# EAGLE design schematic (EAGLE 9.6.2)

## Sheet 1 of 2
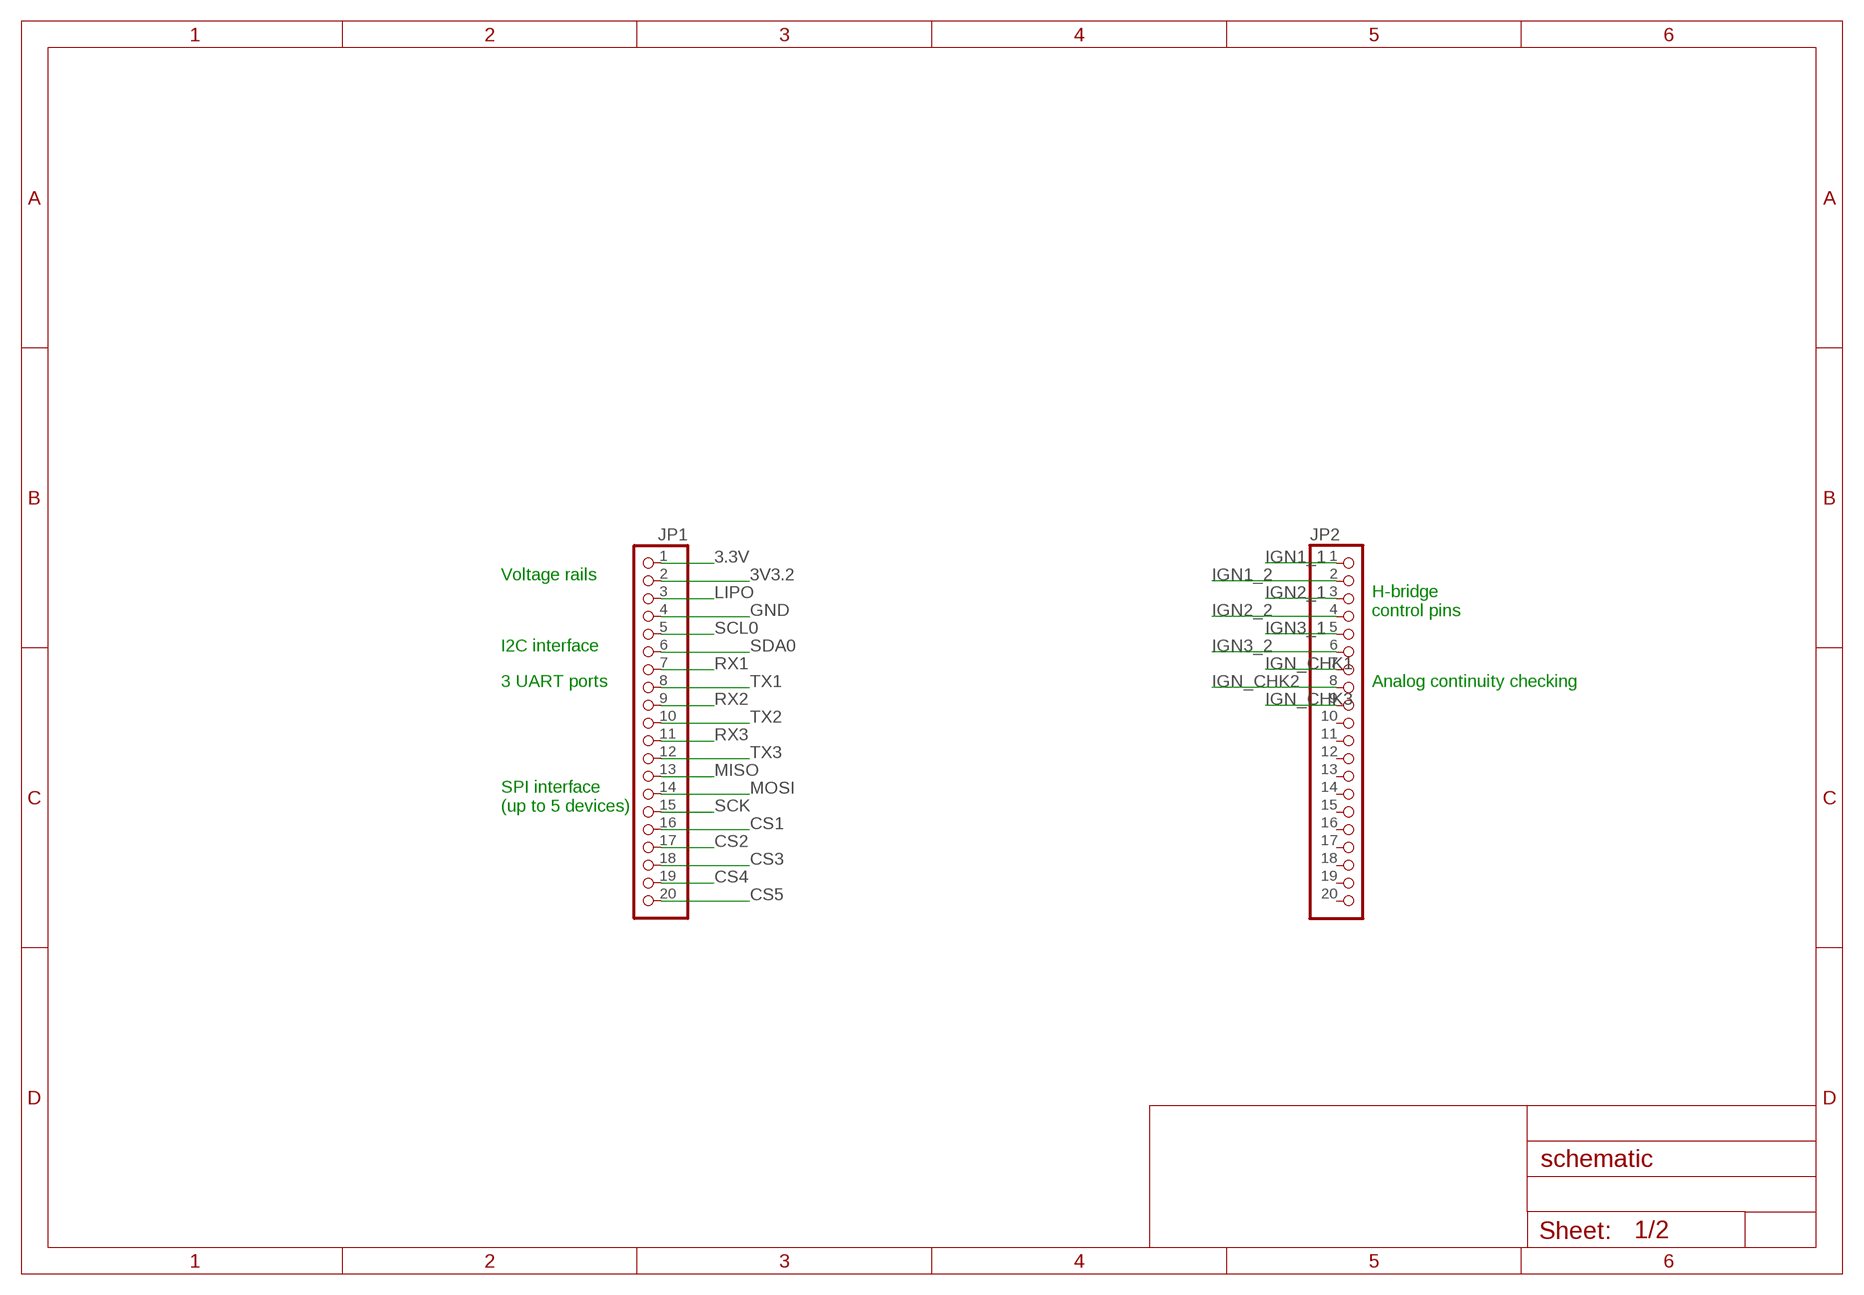
[diagram p0: schematic, sheet 1]

### Parts
JP1  PINHD-1X20  [1X20]
JP2  PINHD-1X20  [1X20]

### Nets
3.3V [POWER]: JP1.1 ; also sheet 2
3V3.2: JP1.2
CS1: JP1.16 ; also sheet 2
CS2: JP1.17 ; also sheet 2
CS3: JP1.18 ; also sheet 2
CS4: JP1.19 ; also sheet 2
CS5: JP1.20 ; also sheet 2
GND [POWER]: JP1.4 ; also sheet 2
IGN1_1: JP2.1 ; also sheet 2
IGN1_2: JP2.2 ; also sheet 2
IGN2_1: JP2.3 ; also sheet 2
IGN2_2: JP2.4 ; also sheet 2
IGN3_1: JP2.5 ; also sheet 2
IGN3_2: JP2.6 ; also sheet 2
IGN_CHK1: JP2.7 ; also sheet 2
IGN_CHK2: JP2.8 ; also sheet 2
IGN_CHK3: JP2.9 ; also sheet 2
LIPO [POWER]: JP1.3 ; also sheet 2
MISO: JP1.13 ; also sheet 2
MOSI: JP1.14 ; also sheet 2
RX1: JP1.7 ; also sheet 2
RX2: JP1.9 ; also sheet 2
RX3: JP1.11 ; also sheet 2
SCK: JP1.15 ; also sheet 2
SCL0: JP1.5 ; also sheet 2
SDA0: JP1.6 ; also sheet 2
TX1: JP1.8 ; also sheet 2
TX2: JP1.10 ; also sheet 2
TX3: JP1.12 ; also sheet 2
Unconnected: JP2.10 JP2.11 JP2.12 JP2.13 JP2.14 JP2.15 JP2.16 JP2.17 JP2.18 JP2.19 JP2.20

### Notes on the sheet
- Voltage rails
- H-bridge
  control pins
- I2C interface
- 3 UART ports | Analog continuity checking
- SPI interface
  (up to 5 devices)

## Sheet 2 of 2
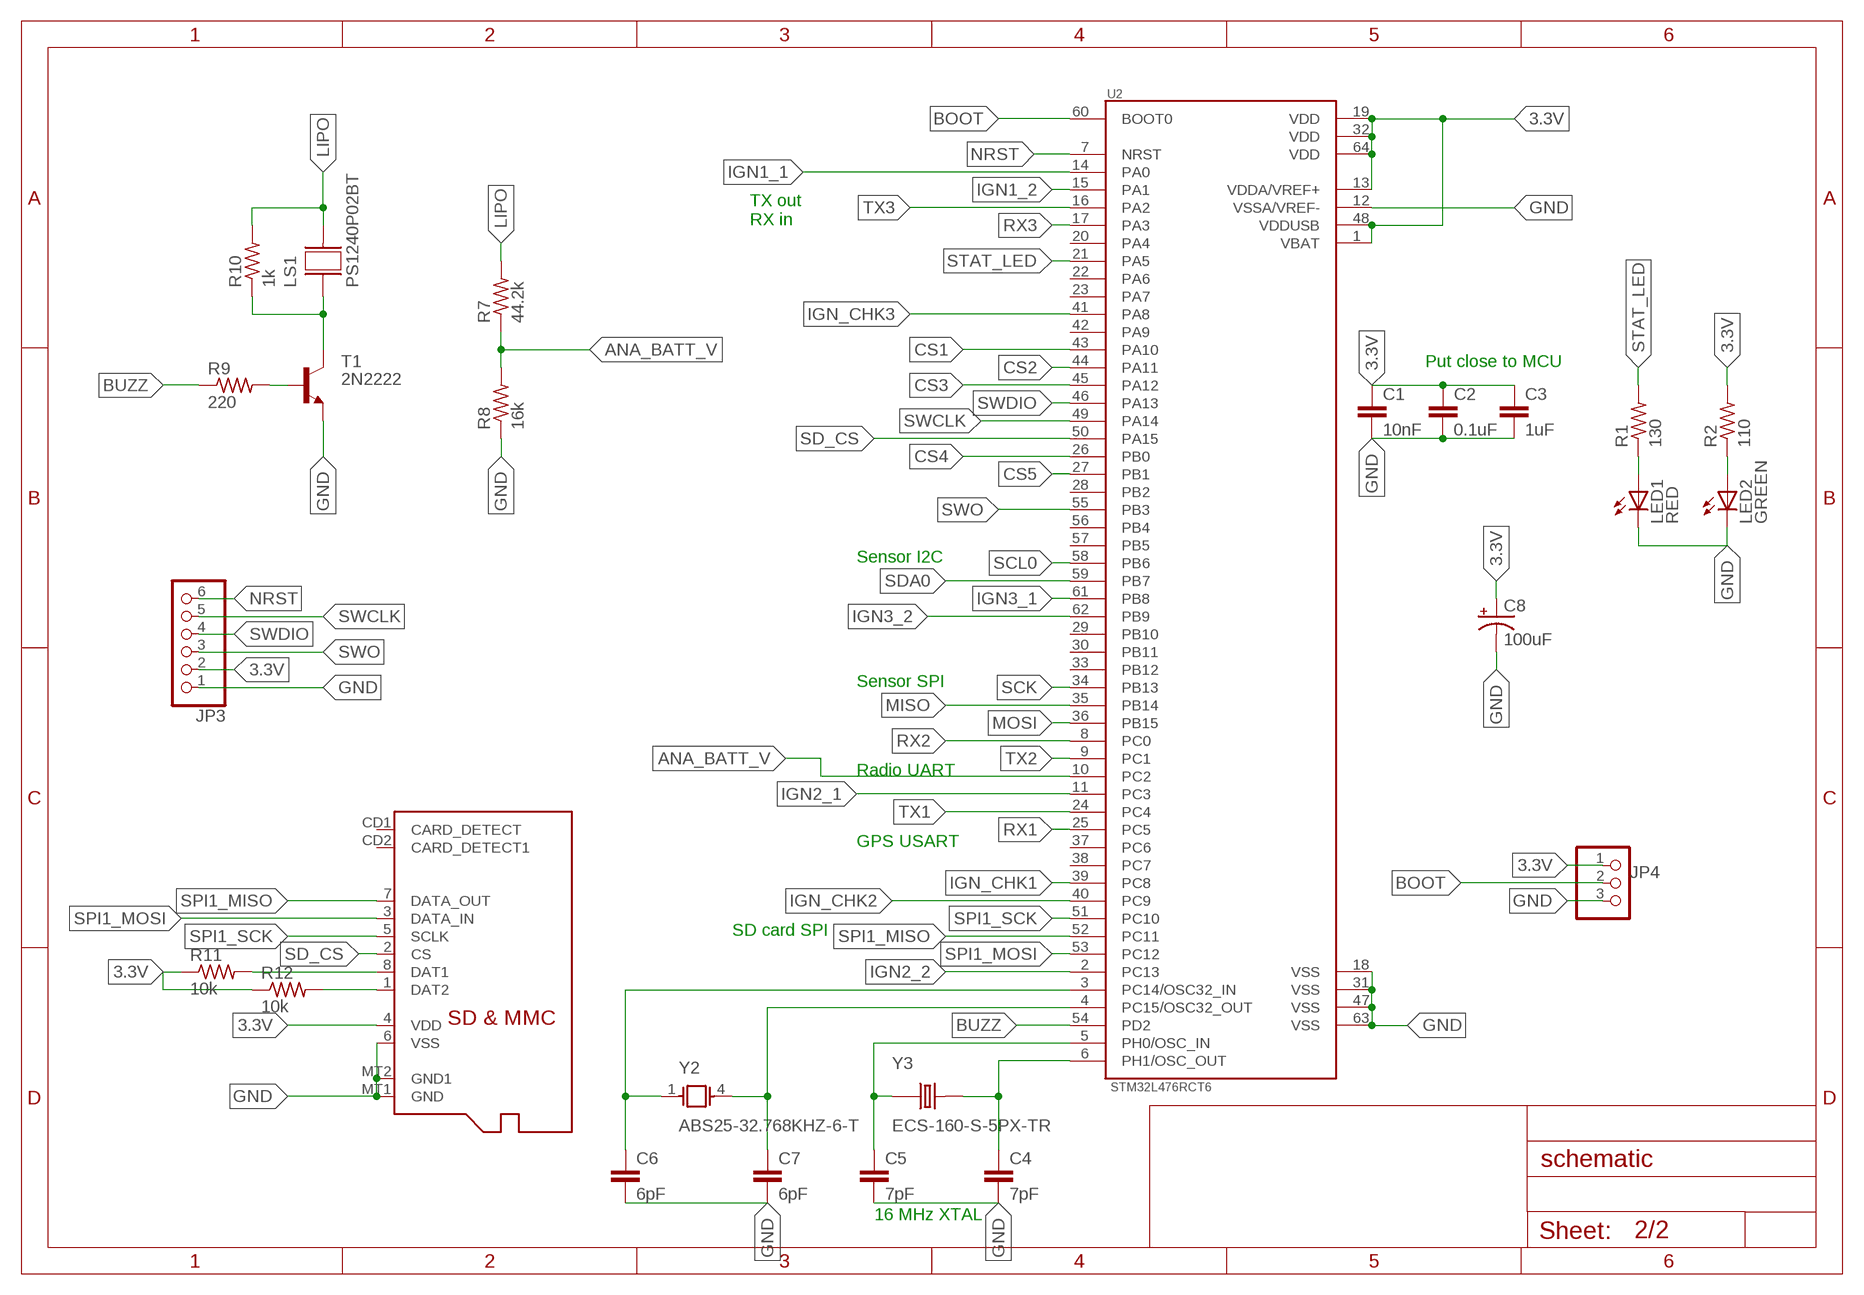
[diagram p1: schematic, sheet 2]

### Parts
C1  10nF  C-EUC0805  [C0805]
C2  0.1uF  C-EUC0805  [C0805]
C3  1uF  C-EUC0805  [C0805]
C4  7pF  C-EUC0805  [C0805]
C5  7pF  C-EUC0805  [C0805]
C6  6pF  C-EUC0805  [C0805]
C7  6pF  C-EUC0805  [C0805]
C8  100uF  CPOL-USB45181B  [B45181B]
JP3  PINHD-1X6  [1X06]
JP4  PINHD-1X3  [1X03]
LED1  RED  LEDCHIPLED_0805  [CHIPLED_0805]
LED2  GREEN  LEDCHIPLED_0805  [CHIPLED_0805]
LS1  PS1240P02BT  [XDCR_PS1240P02BT]
R1  130  R-US_R0805  [R0805]
R2  110  R-US_R0805  [R0805]
R7  44.2k  R-US_R0805  [R0805]
R8  16k  R-US_R0805  [R0805]
R9  220  R-US_R0805  [R0805]
R10  1k  R-US_R0805  [R0805]
R11  10k  R-US_R0805  [R0805]
R12  10k  R-US_R0805  [R0805]
T1  2N2222  [TO92-EBC-OVAL]
U2  STM32L476RCT6  [QFP50P120X120X160-64N]
U$1  MICROSD  [MICROSD]
Y2  ABS25-32.768KHZ-6-T  [XTAL_ABS25-32.768KHZ-6-T]
Y3  ECS-160-S-5PX-TR  [XTAL_ECS-160-S-5PX-TR]

### Nets
3.3V [POWER]: C1.1 C2.1 C3.1 C8.+ JP3.2 JP4.1 R2.2 R11.1 R12.1 U2.1(VBAT) U2.13(VDDA/VREF+) U2.19(VDD) U2.32(VDD) U2.48(VDDUSB) U2.64(VDD) U$1.4(VDD) ; also sheet 1
ANA_BATT_V: R7.1 R8.2 U2.10(PC2)
BOOT: JP4.2 U2.60(BOOT0)
BUZZ: R9.1 U2.54(PD2)
CS1: U2.43(PA10) ; also sheet 1
CS2: U2.44(PA11) ; also sheet 1
CS3: U2.45(PA12) ; also sheet 1
CS4: U2.26(PB0) ; also sheet 1
CS5: U2.27(PB1) ; also sheet 1
GND [POWER]: C1.2 C2.2 C3.2 C4.2 C5.2 C6.2 C7.2 C8.- JP3.1 JP4.3 LED1.C LED2.C R8.1 T1.E U2.12(VSSA/VREF-) U2.18(VSS) U2.31(VSS) U2.47(VSS) U2.63(VSS) U$1.6(VSS) U$1.MT1(GND) U$1.MT2(GND1) ; also sheet 1
IGN1_1: U2.14(PA0) ; also sheet 1
IGN1_2: U2.15(PA1) ; also sheet 1
IGN2_1: U2.11(PC3) ; also sheet 1
IGN2_2: U2.2(PC13) ; also sheet 1
IGN3_1: U2.61(PB8) ; also sheet 1
IGN3_2: U2.62(PB9) ; also sheet 1
IGN_CHK1: U2.39(PC8) ; also sheet 1
IGN_CHK2: U2.40(PC9) ; also sheet 1
IGN_CHK3: U2.41(PA8) ; also sheet 1
LIPO [POWER]: LS1.2 R7.2 R10.2 ; also sheet 1
MISO: U2.35(PB14) ; also sheet 1
MOSI: U2.36(PB15) ; also sheet 1
N$1: C5.1 U2.5(PH0/OSC_IN) Y3.1
N$2: R9.2 T1.B
N$3 [POWER]: LS1.1 R10.1 T1.C
N$4: R11.2 U$1.8(DAT1)
N$5: C4.1 U2.6(PH1/OSC_OUT) Y3.2
N$6: R12.2 U$1.1(DAT2)
N$7: LED1.A R1.1
N$8: LED2.A R2.1
N$11: C7.1 U2.4(PC15/OSC32_OUT) Y2.4
N$12: C6.1 U2.3(PC14/OSC32_IN) Y2.1
NRST: JP3.6 U2.7(NRST)
RX1: U2.25(PC5) ; also sheet 1
RX2: U2.8(PC0) ; also sheet 1
RX3: U2.17(PA3) ; also sheet 1
SCK: U2.34(PB13) ; also sheet 1
SCL0: U2.58(PB6) ; also sheet 1
SD_CS: U2.50(PA15) U$1.2(CS)
SDA0: U2.59(PB7) ; also sheet 1
SPI1_MISO: U2.52(PC11) U$1.7(DATA_OUT)
SPI1_MOSI: U2.53(PC12) U$1.3(DATA_IN)
SPI1_SCK: U2.51(PC10) U$1.5(SCLK)
STAT_LED: R1.2 U2.21(PA5)
SWCLK: JP3.5 U2.49(PA14)
SWDIO: JP3.4 U2.46(PA13)
SWO: JP3.3 U2.55(PB3)
TX1: U2.24(PC4) ; also sheet 1
TX2: U2.9(PC1) ; also sheet 1
TX3: U2.16(PA2) ; also sheet 1
Unconnected: U2.20(PA4) U2.22(PA6) U2.23(PA7) U2.28(PB2) U2.29(PB10) U2.30(PB11) U2.33(PB12) U2.37(PC6) U2.38(PC7) U2.42(PA9) U2.56(PB4) U2.57(PB5) U$1.CD1(CARD_DETECT) U$1.CD2(CARD_DETECT1)

### Notes on the sheet
- TX out
  RX in
- Put close to MCU
- Sensor I2C
- Sensor SPI
- Radio UART
- GPS USART
- SD card SPI
- 16 MHz XTAL

## Library data of the parts
C1-C7 = rcl:C-EU: CAPACITOR, European symbol; SPICEPREFIX: C
C8 = rcl:CPOL-US: POLARIZED CAPACITOR, American symbol; SPICEPREFIX: C
JP1 JP2 = adafruit:PINHD-1X20: PIN HEADER
JP3 = adafruit:PINHD-1X6: PIN HEADER
JP4 = adafruit:PINHD-1X3: PIN HEADER
LED1 LED2 = adafruit:LED: LED OSRAM: - CHIPLED LG R971, LG N971, LY N971, LG Q971, LY Q971, LO R971, LY R971 LH N974, LH R974 LS Q976, LO Q976, LY Q976 LO Q996 - Hyper CHIPLED LW Q18S LB Q993, LB Q99A, LB R99A - SideLED LS A670, LO A670, LY A670, LG A670, LP A670 LB A673, LV A673, LT A673, LW A673 LH A674 LY A675 LS A676, LA A676, LO A676, LY A676, LW A676 LS A679, LY A679, LG A679 - Hyper Micro SIDELED® LS Y876, LA Y876, LO Y876, LY Y876 LT Y87S - SmartLED LW L88C, LW L88S LB L89C, LB L89S, LG L890 LS L89K, LO L89K, LY L89K LS L896, LA L896, LO L896, LY L896 - TOPLED LS T670, LO T670, LY T670, LG T670, LP T670 LSG T670, LSP T670, LSY T670, LOP T670, LYG T670 LG T671, LOG T671, LSG T671 LB T673, LV T673, LT T673, LW T673 LH T674 LS T676, LA T676, LO T676, LY T676, LB T676, LH T676, LSB T676, LW T676 LB T67C, LV T67C, LT T67C, LS T67K, LO T67K, LY T67K, LW E67C LS E67B, LA E67B, LO E67B, LY E67B, LB E67C, LV E67C, LT E67C LW T67C LS T679, LY T679, LG T679 LS T770, LO T770, LY T770, LG T770, LP T770 LB T773, LV T773, LT T773, LW T773 LH T774 LS E675, LA E675, LY E675, LS T675 LS T776, LA T776, LO T776, LY T776, LB T776 LHGB T686 LT T68C, LB T68C - Hyper Mini TOPLED® LB M676 - Mini TOPLED Santana® LG M470 LS M47K, LO M47K, LY M47K Source: http://www.osram.convergy.de/
LS1 = PS1240P02BT:PS1240P02BT: Buzzers Transducer, Externally Driven Piezo 3V 4kHz 60dB @ 3V, 10cm Through Hole PC Pins Check availability <https://pricing.snapeda.com/parts/PS1240P02BT/TDK/view-part?ref=eda>; AVAILABILITY: In Stock; DESCRIPTION: Buzzers Transducer, Externally Driven Piezo 3 V - 4kHz 60dB @ 3V, 10cm Through Hole PC Pins; MF: TDK; MP: PS1240P02BT; PACKAGE: None; PRICE: None; PURCHASE-URL: https://pricing.snapeda.com/search/part/PS1240P02BT/?ref=eda
R1 R2 R7-R12 = adafruit:R-US_: RESISTOR, American symbol
T1 = adafruit:2N2222: NPN TRANSISTOR Big oval pads
U2 = STM32L476RCT6:STM32L476RCT6: Ultra-low-power with FPU ARM Cortex-M4 MCU 80 MHz with 256 Kbytes Flash , LCD, USB OTG Check availability <https://pricing.snapeda.com/parts/STM32L476RCT6/STMicroelectronics/view-part?ref=eda>; AVAILABILITY: In Stock; DESCRIPTION: ARM® Cortex®-M4 STM32L4 Microcontroller IC 32-Bit Single-Core 80MHz 256KB (256K x 8) FLASH 64-LQFP (10x10); MF: STMicroelectronics; MP: STM32L476RCT6; PACKAGE: LQFP-64 STMicroelectronics; PRICE: None; PURCHASE-URL: https://pricing.snapeda.com/search/part/STM32L476RCT6/?ref=eda
U$1 = adafruit:MICROSD: Micro-SD / Transflash card holder with SPI pinout For the 3M # 2908-05WB-MG and/or 4UCON #19656 push-push type
Y2 = ABS25-32.768KHZ-6-T:ABS25-32.768KHZ-6-T: ABS25 Series 32.768 kHz ±20 ppm 6 pF -40 to +85 °C SMT Low Frequency Crystal Check availability <https://pricing.snapeda.com/parts/ABS25-32.768KHZ-6-T/Abracon/view-part?ref=eda>; AVAILABILITY: In Stock; DESCRIPTION: 32.768 kHz ±20ppm Crystal 6pF 50 kOhms 4-SOJ, 5.50mm pitch; MF: Abracon; MP: ABS25-32.768KHZ-6-T; PACKAGE: 4-4 Abracon; PRICE: None; PURCHASE-URL: https://pricing.snapeda.com/search/part/ABS25-32.768KHZ-6-T/?ref=eda
Y3 = ECS-160-S-5PX-TR:ECS-160-S-5PX-TR: CRYSTAL SMD Check availability <https://pricing.snapeda.com/parts/ECS-160-S-5PX-TR/ECS%20Inc./view-part?ref=eda>; AVAILABILITY: In Stock; DESCRIPTION: 16 MHz ±30ppm Crystal Series 40 Ohms HC-49/US; MF: ECS Inc.; MP: ECS-160-S-5PX-TR; PACKAGE: HC49/US ECS International; PRICE: None; PURCHASE-URL: https://pricing.snapeda.com/search/part/ECS-160-S-5PX-TR/?ref=eda

## Net classes
1 POWER: width 0.015 mm

## Board
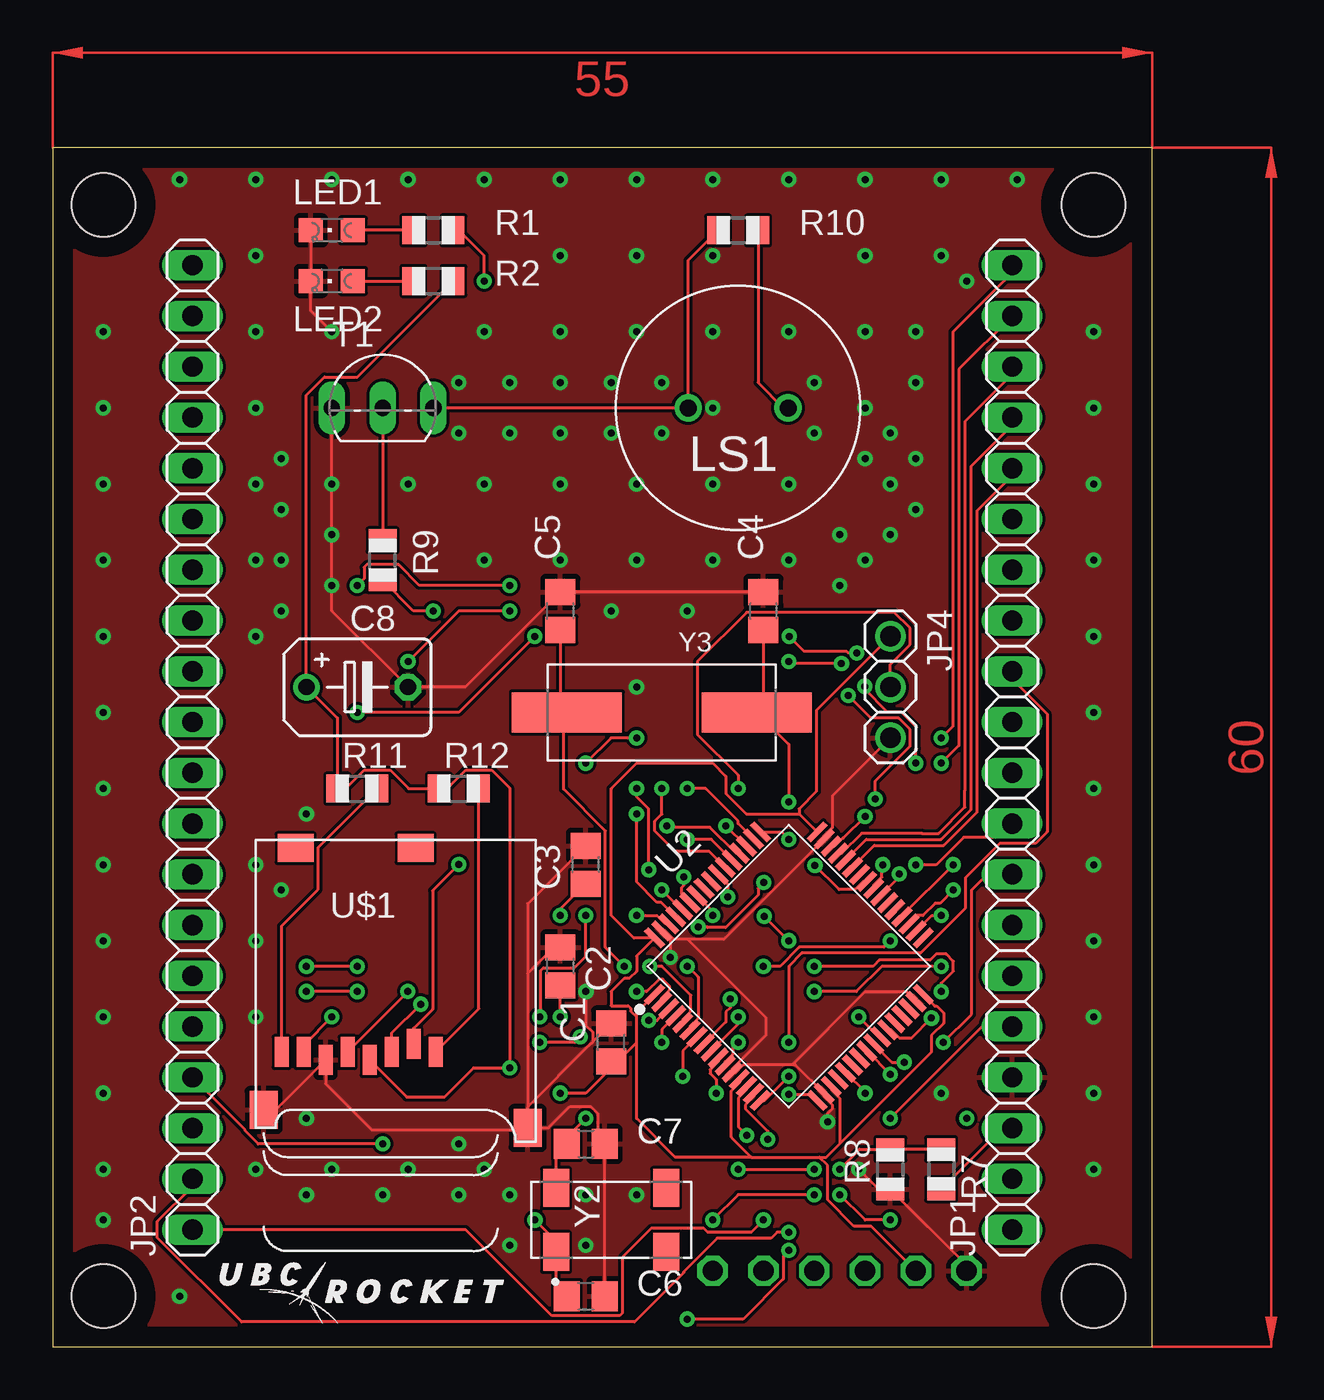
[diagram p2: board, top side]
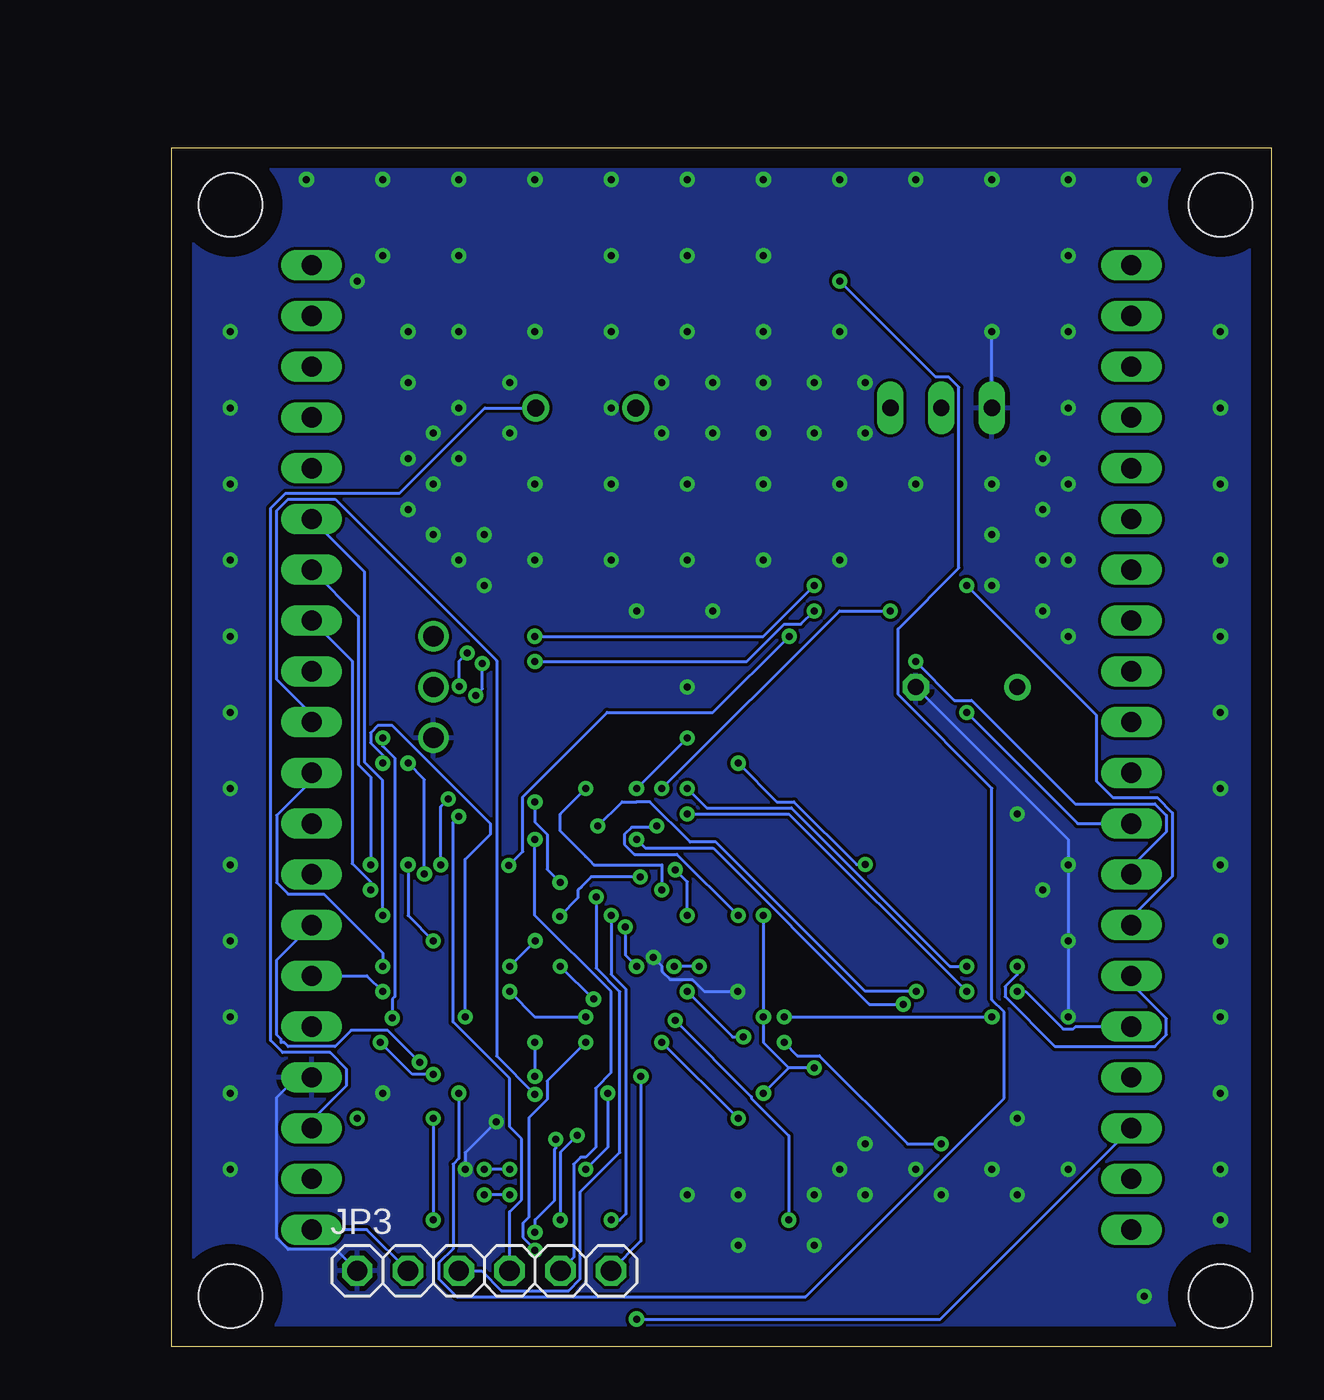
[diagram p3: board, bottom side, seen from below]

Size 55 x 60 mm. Coordinates in mm from the lower left corner, seen from the top.
Outline: 0,0 55,0 55,60 0,60 0,0
Copper layers (1*16): Top 0.035mm / dielectric 1.5mm / Bottom 0.035mm
Design rules "default *": minimum track width 6mil, minimum drill 0.35mm, track to track 6mil, track to pad 6mil, pad to pad 6mil, via to via 6mil, smd to smd 6mil, copper to edge 40mil, drill to drill 6mil, minimum pad ring 10mil, minimum via ring 8mil, stop-mask expansion 4mil, vias tented up to drill 15mil, thermal gap 10mil
Holes 3.17 mm at 2.54,2.54 52.07,2.54 52.07,57.15 2.54,57.15

### Footprints (pad centres in the part's own frame; a part is rotated, then mirrored left to right if it is on the bottom)
C0805 = smd 1.3 x 1.5: 1 -0.95,0; 2 0.95,0
B45181B = drill 0.813: + -2.54,0 | drill 0.813 octagon: - 2.54,0
1X20 = drill 1.016 long: 1 -24.13,0; 2 -21.59,0; 3 -19.05,0; 4 -16.51,0; 5 -13.97,0; 6 -11.43,0; 7 -8.89,0; 8 -6.35,0; 9 -3.81,0; 10 -1.27,0; 11 1.27,0; 12 3.81,0; 13 6.35,0; 14 8.89,0; 15 11.43,0; 16 13.97,0; 17 16.51,0; 18 19.05,0; 19 21.59,0; 20 24.13,0
1X06 = drill 1.016 octagon: 1 -6.35,0; 2 -3.81,0; 3 -1.27,0; 4 1.27,0; 5 3.81,0; 6 6.35,0
1X03 = drill 1.016: 1 -2.54,0; 2 0,0; 3 2.54,0
CHIPLED_0805 = smd 1.2 x 1.2: A 0,-1.05; C 0,1.05
XDCR_PS1240P02BT = drill 0.85 pad 1.28: 1 -2.5,0; 2 2.5,0
R0805 = smd 1.1 x 1.4: 1 -1,0; 2 1,0
TO92-EBC-OVAL = drill 0.813 long: B 0,-1.27; C 2.54,-1.27; E -2.54,-1.27
QFP50P120X120X160-64N = smd 1.2 x 0.3: 1 -5.75,3.75; 2 -5.75,3.25; 3 -5.75,2.75; 4 -5.75,2.25; 5 -5.75,1.75; 6 -5.75,1.25; 7 -5.75,0.75; 8 -5.75,0.25; 9 -5.75,-0.25; 10 -5.75,-0.75; 11 -5.75,-1.25; 12 -5.75,-1.75; 13 -5.75,-2.25; 14 -5.75,-2.75; 15 -5.75,-3.25; 16 -5.75,-3.75; 33 5.75,-3.75; 34 5.75,-3.25; 35 5.75,-2.75; 36 5.75,-2.25; 37 5.75,-1.75; 38 5.75,-1.25; 39 5.75,-0.75; 40 5.75,-0.25; 41 5.75,0.25; 42 5.75,0.75; 43 5.75,1.25; 44 5.75,1.75; 45 5.75,2.25; 46 5.75,2.75; 47 5.75,3.25; 48 5.75,3.75 | smd 0.3 x 1.2: 17 -3.75,-5.75; 18 -3.25,-5.75; 19 -2.75,-5.75; 20 -2.25,-5.75; 21 -1.75,-5.75; 22 -1.25,-5.75; 23 -0.75,-5.75; 24 -0.25,-5.75; 25 0.25,-5.75; 26 0.75,-5.75; 27 1.25,-5.75; 28 1.75,-5.75; 29 2.25,-5.75; 30 2.75,-5.75; 31 3.25,-5.75; 32 3.75,-5.75; 49 3.75,5.75; 50 3.25,5.75; 51 2.75,5.75; 52 2.25,5.75; 53 1.75,5.75; 54 1.25,5.75; 55 0.75,5.75; 56 0.25,5.75; 57 -0.25,5.75; 58 -0.75,5.75; 59 -1.25,5.75; 60 -1.75,5.75; 61 -2.25,5.75; 62 -2.75,5.75; 63 -3.25,5.75; 64 -3.75,5.75
MICROSD = smd 0.7 x 1.5: 1 9,-10.64; 2 7.9,-10.24; 3 6.8,-10.64; 4 5.7,-11.04; 5 4.6,-10.64; 6 3.5,-11.04; 7 2.4,-10.64; 8 1.3,-10.64 | smd 1.8 x 1.4: CD1 2,-0.44; CD2 8,-0.44 | smd 1.4 x 1.9: MT1 0.4,-13.54; MT2 13.6,-14.44
XTAL_ABS25-32.768KHZ-6-T = smd 1.9 x 1.3: 1 -1.6,2.75; 2 -1.6,-2.75; 3 1.6,-2.75; 4 1.6,2.75
XTAL_ECS-160-S-5PX-TR = smd 5.5 x 2: 1 -4.75,0; 2 4.75,0

### Placement (x,y rotation side)
C1  27.94,15.24 90 top
C2  25.4,19.05 90 top
C3  26.67,24.13 90 top
C4  35.56,36.83 90 top
C5  25.4,36.83 90 top
C6  26.67,2.54 0 top
C7  26.67,10.16 0 top
C8  15.24,33.02 0 top
JP1  48,30 90 top
JP2  7,30 90 top
JP3  39.37,3.81 0 bottom
JP4  41.91,33.02 270 top
LED1  13.97,55.88 90 top
LED2  13.97,53.34 90 top
LS1  34.29,46.99 0 top
R1  19.05,55.88 0 top
R2  19.05,53.34 0 top
R7  44.45,8.89 270 top
R8  41.91,8.89 90 top
R9  16.51,39.37 90 top
R10  34.29,55.88 0 top
R11  15.24,27.94 0 top
R12  20.32,27.94 0 top
T1  16.51,48.26 0 top
U2  36.83,19.05 45 top
U$1  10.16,25.4 0 top
Y2  27.94,6.35 90 top
Y3  30.48,31.75 0 top

### Tracks (layer width: path | path; a pad name or v marks a point on that pad's centre or on a via)
3.3V  (via drill 0.35)
  Top 0.152: U2.19 38.95,12.87 39.37,12.45 39.37,10.16 | U2.13 34.35,13.22 33.95,12.82 33.95,10.5 34.95,9.5 | 37.34,26.67 U2.48 | 39.37,10.16 43.95,14.74 43.95,15.58 44.57,16.2 44.57,16.7 44.22,17.06 44.12,17.06 U2.32 | 39.37,10.16 38.71,9.5 38.35,9.5 | R2.2 15.25,48.54 13.6,48.54 12.7,47.64 C8.+ 14.24,31.48 R11.1 14.67,27.94 15.6,28.87 16.89,28.87 17.81,27.94 R12.1 19.75,27.94 20.68,28.87 21.96,28.87 22.86,27.97 v22.86,13.97 21.06,13.97 19.61,12.51 17.71,12.51 U$1.4 | C3.1 25.4,21.91 v25.4,21.59 | v25.4,16.51 C2.1 | 34.95,9.5 38.35,9.5 | 34.95,9.5 31.14,9.5 29.21,11.43 29.21,15.24 | U2.1 29.21,16.73 29.21,16.51 | 29.21,15.24 29.21,16.51 | C1.1 27.94,13.97 | 27.94,13.97 26.67,12.7 v25.4,12.7 | 29.21,15.24 27.94,13.97 | JP3.2 40.95,6.04 40.09,6.04 38.76,7.37 38.76,9.09 38.35,9.5 | JP4.1 38.21,31.86 38.21,27.8 37.34,26.93 37.34,26.67 | 37.34,26.67 34.7,26.67 33.68,27.69 33.68,28.55 33.02,29.21 29.21,29.21 27.94,27.94 27.95,27.93 27.95,21.59 29.08,20.46 U2.64 29.21,19.56 29.21,18.8 28.86,18.44 28.6,18.44 27.94,17.78 27.94,17.07 28.79,17.07 28.92,16.93 28.92,16.8 29.21,16.51
  Bottom 0.152: v25.4,21.59 v25.4,16.51 25.4,15.24 24.13,13.97 | JP3.2 45.24,5.87 JP1.1 | v22.86,13.97 24.13,13.97 | 24.13,13.97 v25.4,12.7
ANA_BATT_V  (via drill 0.35)
  Top 0.152: R7.1 R8.2 40.37,9.89 v39.37,8.89 | U2.10 33.29,14.28 32.89,13.88 32.89,13.69 33.19,13.38 v33.19,12.7 | v34.29,8.89 v38.1,8.89
  Bottom 0.152: v33.19,12.7 33.19,9.99 v34.29,8.89 | v38.1,8.89 v39.37,8.89
BOOT  (via drill 0.35)
  Top 0.152: U2.60 31.46,21.88 v30.48,22.86 | v34.29,27.94 34.29,28.62 32.25,30.66 32.25,34.3 34.72,36.76 42.11,36.76 42.9,35.97 42.9,35.15 41.91,34.16 JP4.2
  Bottom 0.152: v30.48,22.86 30.48,24.13 33.88,24.13 34.09,24.34 34.29,24.54 35.56,25.81 35.56,26.67 v34.29,27.94
BUZZ  (via drill 0.35)
  Top 0.152: U2.54 32.85,24.79 31.14,24.79 30.12,25.81 30.12,26.32 30.48,26.67 v30.48,27.94 | v19.05,36.83 18.05,36.83 R9.1
  Bottom 0.152: v30.48,27.94 21.59,36.83 v19.05,36.83
CS1
  Top 0.152: JP1.16 48,43.59 46.25,41.84 46.25,26.77 44.58,25.09 41.11,25.09 U2.43
CS2
  Top 0.152: JP1.17 48,46.13 45.94,44.08 45.94,26.89 44.45,25.4 40.7,25.4 U2.44
CS3
  Top 0.152: JP1.18 48,48.67 45.64,46.31 45.64,27.94 45.64,27.86 45.64,27.02 44.32,25.7 43.48,25.7 43.18,25.7 40.48,25.7 39.48,24.71 U2.45
CS4  (via drill 0.35)
  Top 0.152: JP1.19 45.33,48.92 45.33,30.09 v44.45,29.21 | U2.26 41.32,15.51 v40.32,16.51
  Bottom 0.152: v40.32,16.51 40.32,24.4 39.05,25.67 39.05,26.17 43.97,31.09 44.7,31.09 45.06,30.73 45.06,30.23 44.45,29.62 v44.45,29.21
CS5  (via drill 0.35)
  Top 0.152: v44.45,30.48 45.03,31.06 45.03,50.78 48,53.75 JP1.20 | U2.27 41.95,15.87 42.36,15.46 42.97,15.46 v43.96,16.45
  Bottom 0.152: v44.45,30.48 44.45,30.07 43.84,29.46 43.84,17.53 43.96,17.41 v43.96,16.45
GND  (via drill 0.35)
  Top 0.152: 31.75,20.41 31.04,20.41 30.64,20.82 U2.63 30.9,20.38 v30.9,19.49 | 31.75,20.41 33.6,20.41 U2.47 38.6,25.59 39,25.99 39,27.57 JP4.3 | 31.75,20.41 35.68,16.48 35.68,15.59 34,13.92 U2.12 34.17,13.75 34.58,14.15 37.01,14.15 | 37.01,14.15 37.13,14.15 U2.18 38.6,12.51 39,12.11 39,11.92 38.76,11.68 v38.76,11.27 | 37.01,14.15 40.64,17.78 42.7,17.78 U2.31 | C4.2 C5.2 20.64,33.02 C8.- 13.97,36.83 v13.97,38.1 v13.97,40.64 v13.97,43.18 T1.E | LED1.C LED2.C 12.92,51.85 v13.97,50.8 | U$1.MT2 23.64,10.84 15.98,10.84 13.66,13.17 U$1.6 11.16,11.86 U$1.MT1 10.16,12.26 v10.16,16.51 | U$1.MT2 23.76,12.01 | 23.76,12.01 26.83,15.08 27.01,15.26 | 27.01,15.26 C1.2 | C2.2 25.08,20 23.76,18.68 | 23.76,18.68 23.76,12.01 | C3.2 23.76,22.17 23.76,18.68 | v40.32,8.89 41.46,7.75 42.05,7.75 R8.1 45.72,4.08 JP3.1 | C6.2 C7.2 27.28,10.5 27.28,11.68 26.92,12.04 25.87,12.04 24.8,10.96 U$1.MT2 | v26.68,17.78 26.68,16.09 27.01,15.76 27.01,15.26
  Bottom 0.152: T1.E v13.97,50.8 | v38.76,11.27 40.32,9.71 v40.32,8.89 | C8.- 10.16,25.4 v10.16,24.13 v10.16,20.32 v10.16,16.51 | JP3.1 46.79,4.88 49.17,4.88 49.75,5.46 49.75,12.48 48.74,13.49 JP1.4 | v30.9,19.49 30.48,19.07 30.48,18.8 30.07,18.39 28.96,18.39 28.35,17.78 v26.68,17.78
  other vias: 2.54,50.8 2.54,46.99 2.54,43.18 2.54,39.37 2.54,35.56 2.54,31.75 2.54,27.94 2.54,24.13 2.54,20.32 2.54,16.51 2.54,12.7 2.54,8.89 10.16,8.89 13.97,8.89 17.78,8.89 52.07,8.89 52.07,12.7 44.45,12.7 52.07,16.51 52.07,20.32 52.07,24.13 52.07,27.94 52.07,31.75 52.07,35.56 52.07,39.37 52.07,43.18 52.07,46.99 52.07,50.8 48.26,58.42 44.45,58.42 40.64,58.42 36.83,58.42 33.02,58.42 29.21,58.42 25.4,58.42 21.59,58.42 17.78,58.42 13.97,58.42 10.16,58.42 6.35,58.42 10.16,54.61 10.16,50.8 10.16,46.99 10.16,43.18 10.16,39.37 10.16,35.56 17.78,43.18 21.59,43.18 21.59,39.37 25.4,39.37 25.4,43.18 29.21,43.18 29.21,39.37 33.02,39.37 33.02,43.18 36.83,43.18 36.83,39.37 40.64,39.37 40.64,46.99 40.64,50.8 36.83,50.8 33.02,50.8 33.02,46.99 30.48,45.72 27.94,45.72 25.4,45.72 22.86,45.72 20.32,45.72 20.32,48.26 22.86,48.26 25.4,48.26 27.94,48.26 30.48,48.26 29.21,50.8 25.4,50.8 21.59,50.8 25.4,54.61 29.21,54.61 33.02,54.61 40.64,54.61 44.45,54.61 38.1,45.72 40.64,44.45 41.91,43.18 43.18,41.91 43.18,44.45 41.91,45.72 38.1,48.26 11.43,44.45 11.43,41.91 11.43,39.37 11.43,36.83 27.94,36.83 31.75,36.83 29.21,33.02 39.37,38.1 39.37,40.64 41.91,40.64 43.18,48.26 43.18,50.8 45.72,53.34 12.7,26.67 11.43,22.86 12.7,11.43 12.7,7.62 16.51,7.62 20.32,7.62 22.86,7.62 21.59,8.89 20.32,10.16 22.86,5.08 26.67,5.08 26.67,7.62 29.21,7.62 6.35,2.54 2.54,6.35
  pour Top: 0,59.69 0,0 54.61,0 54.61,59.69
  pour Bottom: 0,59.69 0,0 54.61,0 54.61,59.69
IGN1_1  (via drill 0.35)
  Top 0.152: U2.14 34.71,12.87 34.3,12.46 34.3,11.01 v34.72,10.59 | JP2.1 20.67,5.87 24.98,1.56 28.36,1.56 28.5,1.7 28.5,4.48 29.95,5.93 31.43,5.93 32.58,5.93 32.77,5.74 34.95,5.74 v35.56,6.35
  Bottom 0.152: v34.72,10.59 35.56,9.75 v35.56,6.35
IGN1_2  (via drill 0.35)
  Top 0.152: U2.15 35.06,12.51 34.66,12.11 34.66,11.92 35.78,10.79 v35.78,10.38 | v36.83,5.74 36.24,5.74 35.94,5.44 33.25,5.44 31.57,3.76 31.57,3.71 29.12,1.26 9.45,1.26 5.25,5.46 5.25,6.28 7,8.03 JP2.2
  Bottom 0.152: v36.83,5.74 36.83,6.37 36.81,6.37 35.87,7.32 35.87,9.87 35.78,9.96 v35.78,10.38
IGN2_1  (via drill 0.35)
  Top 0.152: U2.11 33.65,14.27 34.05,14.68 34.05,15 v34.29,15.24 | v36.83,4.83 36.55,4.55 36.55,3.4 34.55,1.39 v31.75,1.39
  Bottom 0.152: v34.29,15.24 36.22,13.31 36.22,12.38 37.13,11.47 37.13,6.5 37.44,6.19 37.44,5.49 36.83,4.88 v36.83,4.83 | v31.75,1.39 16.56,1.39 JP2.3
IGN2_2  (via drill 0.35)
  Top 0.152: U2.2 30.47,17.45 30.87,17.86 30.87,18.05 30.52,18.39 30.34,18.39 29.72,17.78 v29.21,17.78 | v26.4,15.51 26.13,15.24 v24.37,15.24 | JP2.4 9.63,10.86 9.63,10.81 10.29,10.16 v16.51,10.16
  Bottom 0.152: v29.21,17.78 26.94,15.51 v26.4,15.51 | v24.37,15.24 23.7,14.58 22.61,14.58 18.19,10.16 v16.51,10.16
IGN3_1  (via drill 0.35)
  Top 0.152: U2.61 30.45,22.25 30.23,22.25 29.21,23.27 v29.21,26.67 | v15.24,17.78 v12.7,17.78
  Bottom 0.152: v29.21,26.67 24.13,26.67 v15.24,17.78 | v12.7,17.78 12.29,17.78 10.41,15.9 9.91,15.9 9.78,16.03 JP2.5
IGN3_2  (via drill 0.35)
  Top 0.152: U2.62 30.65,21.17 30.24,21.58 29.22,21.58 v29.21,21.59 | v29.21,27.94 29.21,27.53 29.82,26.92 v29.82,23.88 | v15.24,19.05 v12.7,19.05
  Bottom 0.152: v29.21,21.59 29.21,23.27 v29.82,23.88 | v29.21,27.94 28.25,26.98 24,26.98 16.08,19.05 v15.24,19.05 | JP2.6 7,18.19 5.25,16.44 5.25,15.62 5.83,15.04 10.82,15.04 13.31,17.53 13.31,18.03 12.7,18.64 v12.7,19.05
IGN_CHK1  (via drill 0.35)
  Top 0.152: U2.39 42.36,23.52 v42.36,23.67 | v43.18,29.21 43.18,29.92 43.2,29.94 43.2,31.02 42.45,31.77 41.75,31.77 40.62,32.91 v40.62,33.06 | v40.22,34.73 39.79,34.73 39.71,34.8 37.6,34.8 v36.84,35.56 | v22.86,38.1 18.35,38.1 17.3,39.15 15.71,39.15 15.58,39.02 15.58,38.44 v15.24,38.1
  Bottom 0.152: v42.36,23.67 42.36,28.39 v43.18,29.21 | v40.62,33.06 40.62,34.33 v40.22,34.73 | v36.84,35.56 25.41,35.56 24.5,36.47 24.49,36.47 v22.86,38.1 | v15.24,38.1 8.75,31.61 8.75,28.32 7.92,27.48 5.7,27.48 4.94,26.73 4.94,23.54 7,21.49 JP2.7
IGN_CHK2  (via drill 0.35)
  Top 0.152: U2.40 41.07,23.11 41.48,23.52 41.48,24.07 v41.53,24.13 | v39.8,32.59 40.92,31.47 42.32,31.47 42.9,30.89 42.9,30.07 41.16,28.33 v41.16,27.42 | v39.46,34.2 36.92,34.2 v36.83,34.29 | v17.78,34.29 20.32,36.83 v22.86,36.83
  Bottom 0.152: v41.53,24.13 41.53,27.05 v41.16,27.42 | v39.8,32.59 39.46,32.93 v39.46,34.2 | v22.86,36.83 23.52,36.17 24.37,36.17 26.25,34.29 v36.83,34.29 | v17.78,34.29 15.85,32.36 14.99,32.36 9.81,27.18 5.83,27.18 5.25,26.6 5.25,25.78 7,24.03 JP2.8
IGN_CHK3  (via drill 0.35)
  Top 0.152: U2.41 40.55,23.29 40.14,22.89 39.34,22.89 v38.14,24.09 | v24.12,35.56 20.31,31.75 v15.24,31.75
  Bottom 0.152: v38.14,24.09 37.44,24.79 37.44,27.53 33.22,31.75 27.93,31.75 v24.12,35.56 | v15.24,31.75 9.68,26.19 JP2.9
LIPO
  Top 0.152: R7.2 47.51,10.95 JP1.3 | R10.2 35.29,48.26 36.56,46.99 LS1.2
  Bottom 0.152: JP1.3 48,11.33 46.25,13.08 46.25,13.9 47.08,14.73 49.46,14.73 50.06,15.34 50.06,41.97 49.3,42.73 43.59,42.73 39.33,46.99 LS1.2
MISO  (via drill 0.35)
  Top 0.152: v45.06,22.86 44.39,22.2 44.14,22.2 43.53,21.59 43.18,21.59 42.84,21.25 U2.35
  Bottom 0.152: JP1.13 45.97,34.32 45.97,24.19 45.06,23.27 v45.06,22.86
MOSI  (via drill 0.35)
  Top 0.152: v45.06,24.13 42.49,21.56 U2.36
  Bottom 0.152: JP1.14 45.67,36.56 45.67,29.14 45.06,28.53 v45.06,24.13
N$1  (via drill 0.35)
  Top 0.152: C5.1 25.4,32.08 25.57,31.91 | 25.57,31.91 Y3.1 | U2.5 31.53,16.39 31.93,16.8 31.93,17.6 30.48,19.05 v29.87,19.05 | v28.6,19.05 27.65,20 27.65,25.82 25.57,27.91 25.57,31.91
  Bottom 0.152: v28.6,19.05 v29.87,19.05 | v29.87,19.05
N$2
  Top 0.152: T1.B R9.2
N$3
  Top 0.152: R10.1 31.79,54.38 LS1.1 T1.C
N$4
  Top 0.152: U$1.8 11.46,21.07 13.29,22.89 13.29,24.99 R11.2
N$5  (via drill 0.35)
  Top 0.152: C4.1 35.56,32.08 Y3.2 36.83,30.15 v36.83,27.28 | v35.58,23.25 35.29,22.96 35.29,22.61 33.66,20.98 32.77,20.98 32.73,21.02 v32.31,21.02 | U2.6 31.88,16.04 32.29,16.45 32.29,18.51 v31.75,19.05
  Bottom 0.152: v36.83,27.28 36.83,26.26 36.22,25.65 36.22,23.9 v35.58,23.25 | v32.31,21.02 32.31,19.61 v31.75,19.05
N$6
  Top 0.152: U$1.1 21.32,16.92 R12.2
N$7
  Top 0.152: R1.1 LED1.A
N$8
  Top 0.152: LED2.A R2.1
N$11  (via drill 0.35)
  Top 0.152: U2.4 30.48,15.88 v30.48,15.24 | Y2.4 25.19,9.63 C7.1 25.72,10.48 v26.67,11.43
  Bottom 0.152: v26.67,11.43 v30.48,15.24
N$12  (via drill 0.35)
  Top 0.152: C6.1 25.19,3.07 Y2.1 25.19,5.29 v24.13,6.35 | U2.3 30.22,16.33 v29.82,16.33
  Bottom 0.152: v29.82,16.33 26.01,12.52 26.01,12.45 24.13,10.57 v24.13,6.35
N$15  (via drill 0.35)
  other vias: 45.72,11.43
NRST  (via drill 0.35)
  Top 0.152: U2.7 31.53,14.81 v31.53,13.54
  Bottom 0.152: v31.53,13.54 31.53,5.3 JP3.6
RX1  (via drill 0.35)
  Top 0.152: U2.25 41.98,14.25 v42.6,14.25
  Bottom 0.152: v42.6,14.25 44.2,15.85 46.02,15.85 46.83,15.04 49.17,15.04 49.37,15.24 49.53,15.24 49.53,15.4 49.75,15.62 49.75,19.36 JP1.7
RX2  (via drill 0.35)
  Top 0.152: JP1.9 47.31,25.5 45.57,25.5 44.2,24.13 v43.18,24.13 | v41.91,20.32 41.6,20.01 37.36,20.01 36.4,19.05 v35.56,19.05 | v33.9,17.41 33.9,16.98 33.68,16.76 33.68,16.26 U2.8
  Bottom 0.152: v43.18,24.13 43.18,21.59 v41.91,20.32 | v35.56,19.05 33.91,17.41 v33.9,17.41
RX3  (via drill 0.35)
  Top 0.152: v36.83,12.64 37.94,12.64 U2.17
  Bottom 0.152: v36.83,12.64 38.75,14.55 38.75,34.34 46.83,42.42 49.17,42.42 49.75,41.84 49.75,33.4 48,31.65 JP1.11
SCK  (via drill 0.35)
  Top 0.152: U2.34 43.97,21.59 v44.45,21.59
  Bottom 0.152: JP1.15 45.36,38.79 45.36,29.26 44.45,28.35 v44.45,21.59
SCL0  (via drill 0.35)
  Top 0.152: JP1.5 46.51,16.03 v41.91,11.43 | v41.91,6.35 40.64,6.35 v39.37,7.62 | U2.58 33.02,21.8 v33.02,21.59 | v38.1,7.62 34.29,7.62 v33.02,6.35
  Bottom 0.152: v41.91,11.43 v41.91,6.35 | v33.02,21.59 33.02,18.64 32.28,17.9 32.28,6.66 32.59,6.35 v33.02,6.35 | v38.1,7.62 v39.37,7.62
SD_CS  (via drill 0.35)
  Top 0.152: U2.50 34.29,26.18 34.29,26.32 32.67,27.94 v31.75,27.94 | v29.21,30.48 27.94,30.48 v26.67,29.21 | U$1.2 18.06,15.95 19.01,16.9 19.01,22.84 v20.31,24.14
  Bottom 0.152: v31.75,27.94 v29.21,30.48 | v26.67,29.21 24.74,27.28 23.88,27.28 20.74,24.14 v20.31,24.14
SDA0  (via drill 0.35)
  Top 0.152: v38.1,19.05 41.05,19.05 41.35,19.36 43.9,19.36 44.2,19.66 44.7,19.66 45.06,19.3 45.06,18.8 44.45,18.19 v44.45,17.78 | v36.82,20.33 v35.6,21.55 | v31.57,23.52 31.57,23.1 31.48,23 31.48,22.64 U2.59
  Bottom 0.152: JP1.6 45.24,18.57 v44.45,17.78 | v38.1,19.05 v36.82,20.33 | v35.6,21.55 34.68,22.47 34.68,22.86 34.49,23.06 34.02,23.52 v31.57,23.52
SPI1_MISO  (via drill 0.35)
  Top 0.152: U2.52 34.18,24.71 32.88,26.01 30.79,26.01 v30.73,26.06 | v13.97,16.51 12.56,15.1 U$1.7 | v24.37,16.51 24.42,16.57 24.42,18.84 24.55,18.98 26.1,18.98 26.67,19.55 v26.67,21.59
  Bottom 0.152: v26.67,21.59 29.74,24.66 31.86,24.66 32.36,25.15 32.36,25.65 32,26.01 30.79,26.01 v30.73,26.06 | v24.37,16.51 v13.97,16.51
SPI1_MOSI  (via drill 0.35)
  Top 0.152: U$1.3 16.96,15.71 v18.41,17.15 | U2.53 32.95,25.4 v31.75,25.4
  Bottom 0.152: v31.75,25.4 31.31,24.96 27.91,24.96 20.1,17.15 v18.41,17.15
SPI1_SCK  (via drill 0.35)
  Top 0.152: U$1.5 17.77,17.77 v17.77,17.8 | U2.51 34.69,25.06 v33.69,26.06
  Bottom 0.152: v17.77,17.8 20.32,17.8 27.79,25.27 29.07,25.27 31.09,27.28 31.75,27.28 32.47,27.28 v33.69,26.06
STAT_LED  (via drill 0.35)
  Top 0.152: U2.21 40.64,12.77 v40.64,12.7 | v21.59,53.34 21.59,54.61 20.32,55.88 R1.2
  Bottom 0.152: v40.64,12.7 40.64,9.43 40.93,9.14 40.93,4.92 41.63,4.22 41.63,3.4 40.75,2.52 23.3,2.52 13.36,12.45 13.36,16.76 13.97,17.37 13.97,27.95 18.67,32.65 18.67,35.93 15.62,38.98 15.62,48.02 16.14,48.54 16.79,48.54 v21.59,53.34
SWCLK  (via drill 0.35)
  Top 0.152: U2.49 36.46,25.77 v36.83,25.4
  Bottom 0.152: v36.83,25.4 36.83,21.59 33.02,17.78 33.02,13.73 33.8,12.95 33.8,9.99 34.29,9.5 34.54,9.5 34.9,9.14 34.9,4.47 JP3.5
SWDIO  (via drill 0.35)
  Top 0.152: v40.64,26.55 39.56,25.47 39.53,25.47 39.12,25.06 U2.46
  Bottom 0.152: v40.64,26.55 40.93,26.26 40.93,16.26 38.1,13.43 38.1,11.02 37.49,10.41 37.49,7.37 38.1,6.76 JP3.4
SWO  (via drill 0.35)
  Top 0.152: U2.55 33.77,23.17 v33.77,22.52
  Bottom 0.152: v33.77,22.52 33.77,18.96 32.59,17.78 32.59,9.73 34.57,7.75 34.57,3.4 35.15,2.82 38.51,2.82 39.5,3.81 JP3.3
TX1  (via drill 0.35)
  Top 0.152: U2.24 40.75,14.81 v41.91,13.64 | v44.56,15.24 45.97,16.65 45.97,22.86 46.76,23.65 JP1.8
  Bottom 0.152: v41.91,13.64 42.97,13.64 v44.56,15.24
TX2  (via drill 0.35)
  Top 0.152: v38.1,17.78 40.21,17.78 41.48,19.05 v44.45,19.05 | v34.29,16.51 34.29,16.16 U2.9
  Bottom 0.152: JP1.10 48,28.35 49.75,26.6 49.75,23.24 49.17,22.66 47.39,22.66 44.45,19.72 v44.45,19.05 | v38.1,17.78 36.83,16.51 v34.29,16.51
TX3  (via drill 0.35)
  Top 0.152: JP1.12 48,33.43 49.75,31.68 49.75,25.78 49.17,25.2 47.39,25.2 45.66,23.48 45.66,21.95 43.42,19.7 37.48,19.7 36.83,19.05 v36.83,15.24 | v36.83,13.54 35.62,12.33 U2.16
  Bottom 0.152: v36.83,15.24 v36.83,13.54
(copper drawn outside any net)
  shapes: Top area x2

### Text on the board
tNames: C:/Users/callu/Documents/UBC Rocket/2022 Avionics/image_monochrome.bmp